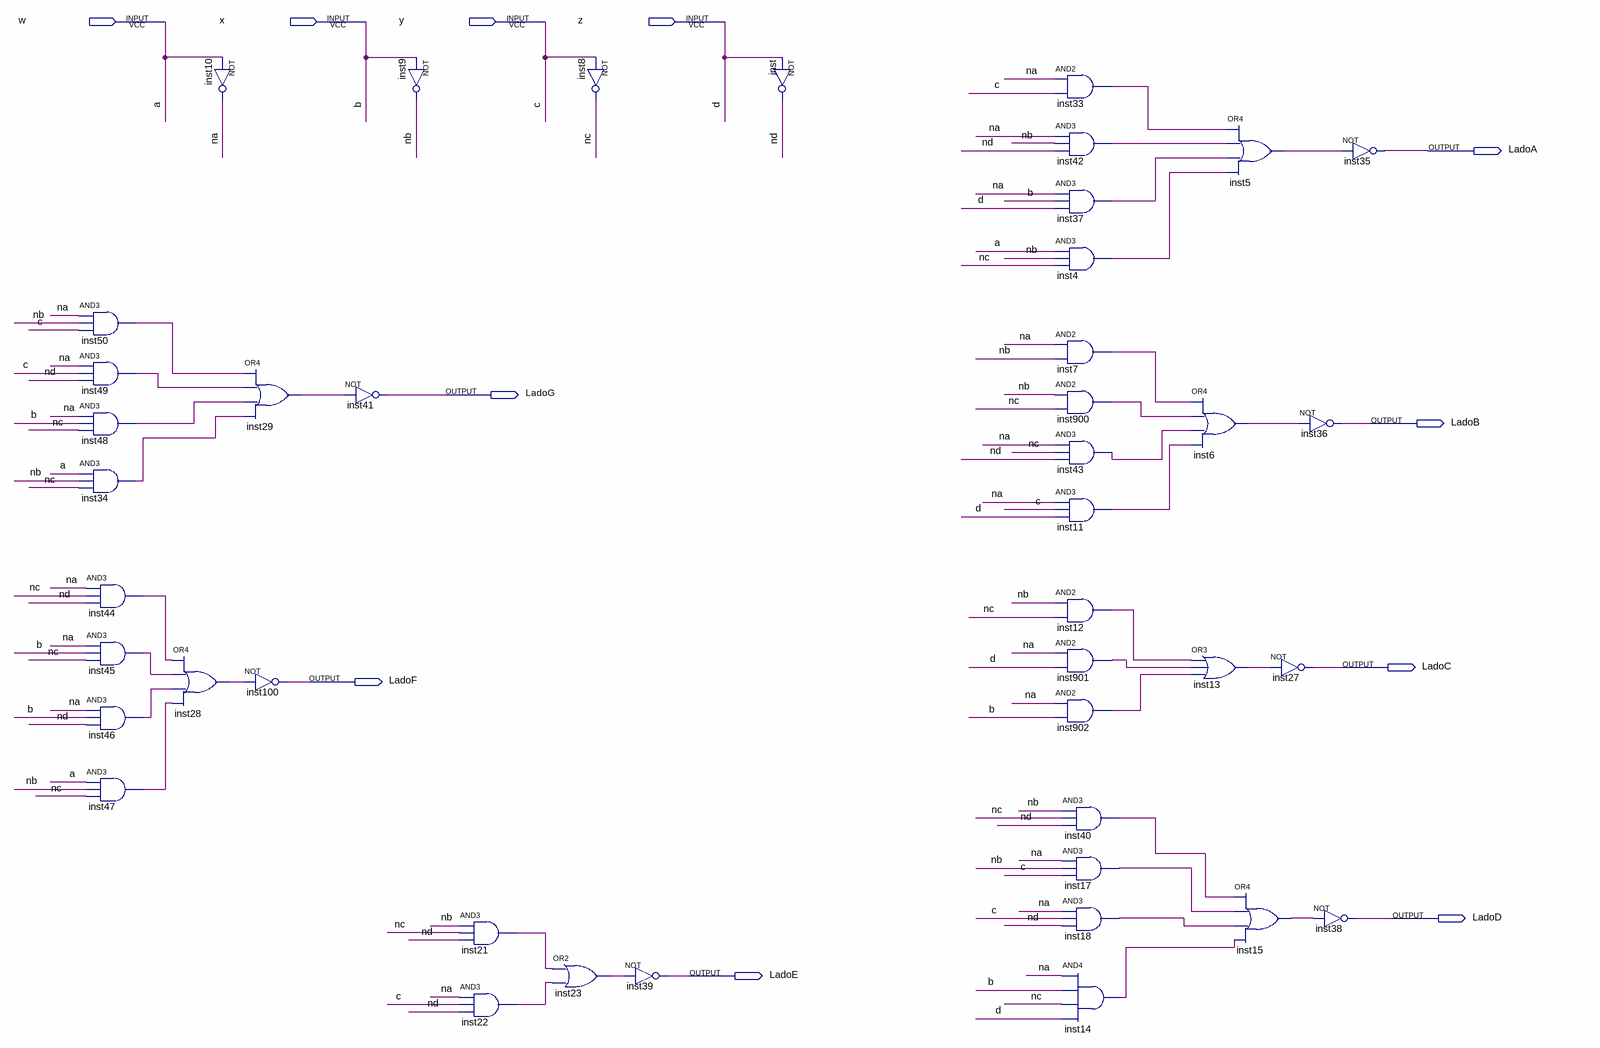
[diagram p0: schematic sheet]
// Quartus schematic Display.bdf as structural Verilog: 43 symbols, 11 pins
module Display (
  input  w,
  input  x,
  input  y,
  input  z,
  output LadoA,
  output LadoG,
  output LadoB,
  output LadoC,
  output LadoF,
  output LadoD,
  output LadoE
);

  wire inst4_out, inst5_out, inst6_out, inst7_out, inst11_out, inst12_out, inst13_out, inst14_out,
       inst15_out, inst17_out, inst18_out, inst21_out, inst22_out, inst23_out, inst28_out, inst29_out,
       inst33_out, inst34_out, inst37_out, inst40_out, inst42_out, inst43_out, inst44_out, inst45_out,
       inst46_out, inst47_out, inst48_out, inst49_out, inst50_out, inst900_out, inst901_out, inst902_out, na,
       nb, nc, nd;

  and inst50 (inst50_out, na, nb, y);
  and inst49 (inst49_out, na, y, nd);
  and inst48 (inst48_out, na, x, nc);
  and inst34 (inst34_out, w, nb, nc);
  and inst44 (inst44_out, na, nc, nd);
  and inst45 (inst45_out, na, x, nc);
  and inst46 (inst46_out, na, x, nd);
  and inst47 (inst47_out, w, nb, nc);
  or inst28 (inst28_out, inst44_out, inst45_out, inst46_out, inst47_out);
  not inst10 (na, w);
  or inst29 (inst29_out, inst50_out, inst49_out, inst48_out, inst34_out);
  not inst100 (LadoF, inst28_out);
  not inst41 (LadoG, inst29_out);
  not inst9 (nb, x);
  and inst21 (inst21_out, nb, nc, nd);
  and inst22 (inst22_out, na, y, nd);
  or inst23 (inst23_out, inst21_out, inst22_out);
  not inst8 (nc, y);
  not inst39 (LadoE, inst23_out);
  not inst (nd, z);
  and inst33 (inst33_out, na, y);
  and inst42 (inst42_out, na, nb, nd);
  and inst37 (inst37_out, na, x, z);
  and inst4 (inst4_out, w, nb, nc);
  and inst7 (inst7_out, na, nb);
  and inst900 (inst900_out, nb, nc);
  and inst43 (inst43_out, na, nc, nd);
  and inst11 (inst11_out, na, y, z);
  and inst12 (inst12_out, nb, nc);
  and inst901 (inst901_out, na, z);
  and inst902 (inst902_out, na, x);
  and inst40 (inst40_out, nb, nc, nd);
  and inst17 (inst17_out, na, nb, y);
  and inst18 (inst18_out, na, y, nd);
  and inst14 (inst14_out, na, x, nc, z);
  or inst6 (inst6_out, inst7_out, inst900_out, inst43_out, inst11_out);
  or inst13 (inst13_out, inst12_out, inst901_out, inst902_out);
  or inst5 (inst5_out, inst33_out, inst42_out, inst37_out, inst4_out);
  or inst15 (inst15_out, inst40_out, inst17_out, inst18_out, inst14_out);
  not inst36 (LadoB, inst6_out);
  not inst27 (LadoC, inst13_out);
  not inst38 (LadoD, inst15_out);
  not inst35 (LadoA, inst5_out);

  // Other names for the same wires on the sheet: a = w; b = x; c = y; d = z
endmodule
